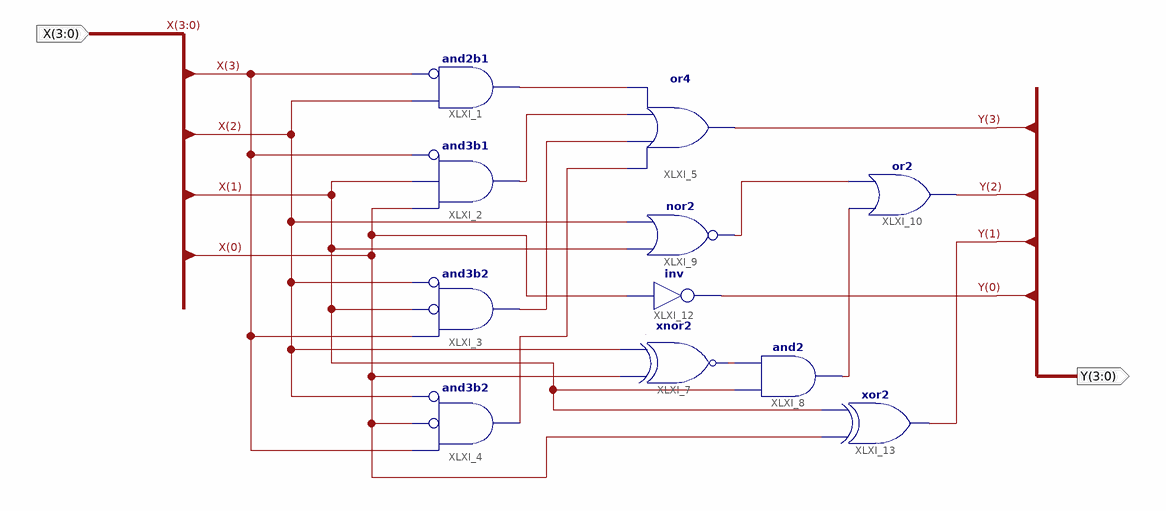
[diagram p0: schematic sheet 1]
// Xilinx ISE schematic rys.sch (xc9500xl) as structural Verilog: 11 symbols, 2 ports
module rys (
  input  [3:0] X,
  output [3:0] Y
);

  wire XLXN_32, XLXN_33, XLXN_34, XLXN_35, XLXN_38, XLXN_39, XLXN_40;

  and XLXI_1 (XLXN_32, ~X[3], X[2]);  // and2b1
  and XLXI_2 (XLXN_33, ~X[3], X[1], X[0]);  // and3b1
  and XLXI_3 (XLXN_34, ~X[2], ~X[1], X[3]);  // and3b2
  and XLXI_4 (XLXN_35, ~X[2], ~X[0], X[3]);  // and3b2
  or XLXI_5 (Y[3], XLXN_32, XLXN_33, XLXN_34, XLXN_35);
  xnor XLXI_7 (XLXN_38, X[2], X[0]);
  and XLXI_8 (XLXN_40, XLXN_38, X[1]);
  nor XLXI_9 (XLXN_39, X[2], X[1]);
  or XLXI_10 (Y[2], XLXN_39, XLXN_40);
  not XLXI_12 (Y[0], X[0]);
  xor XLXI_13 (Y[1], X[1], X[0]);
endmodule
